# EAGLE design CalibrationBoard (EAGLE 6.5.0)
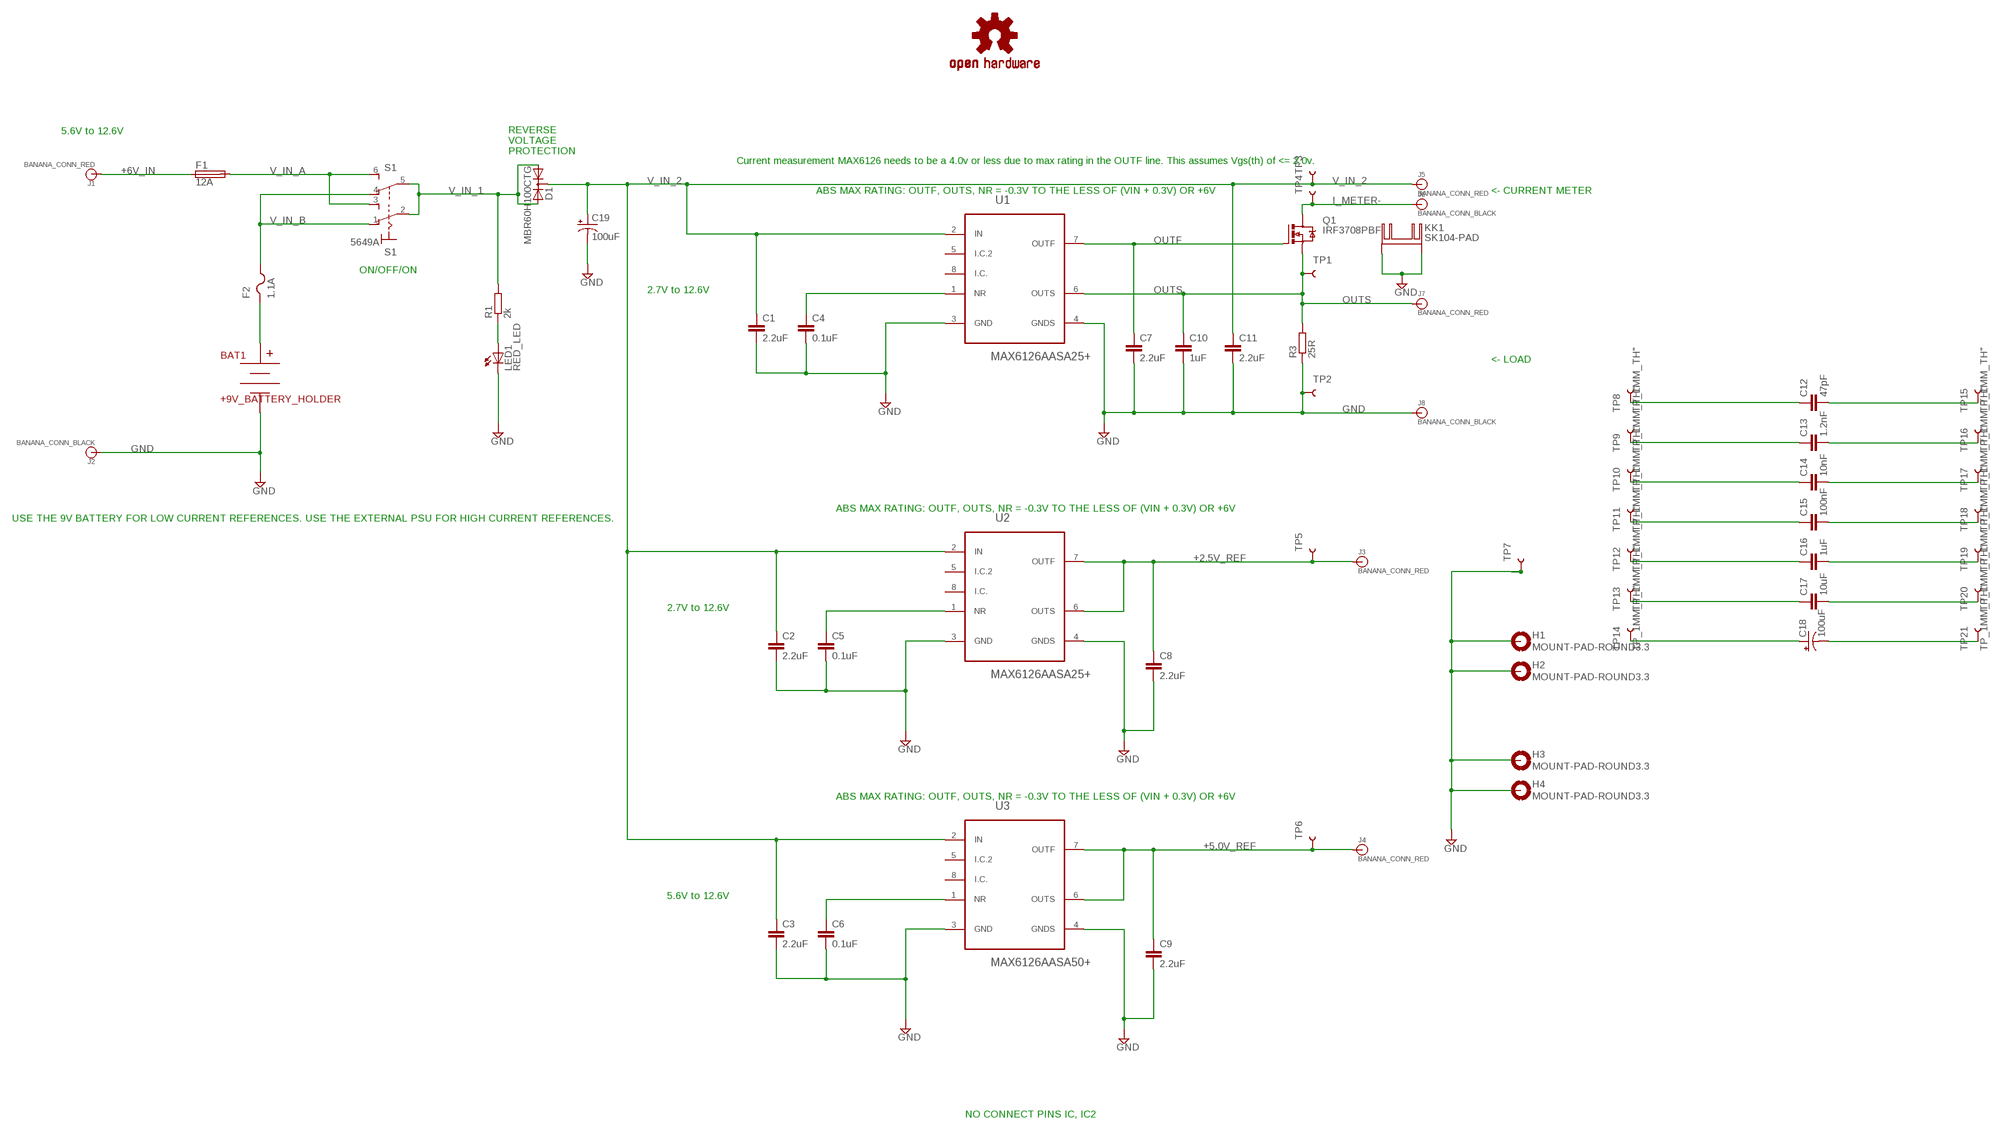
[diagram p0: schematic, sheet 1, part 1 of 2]
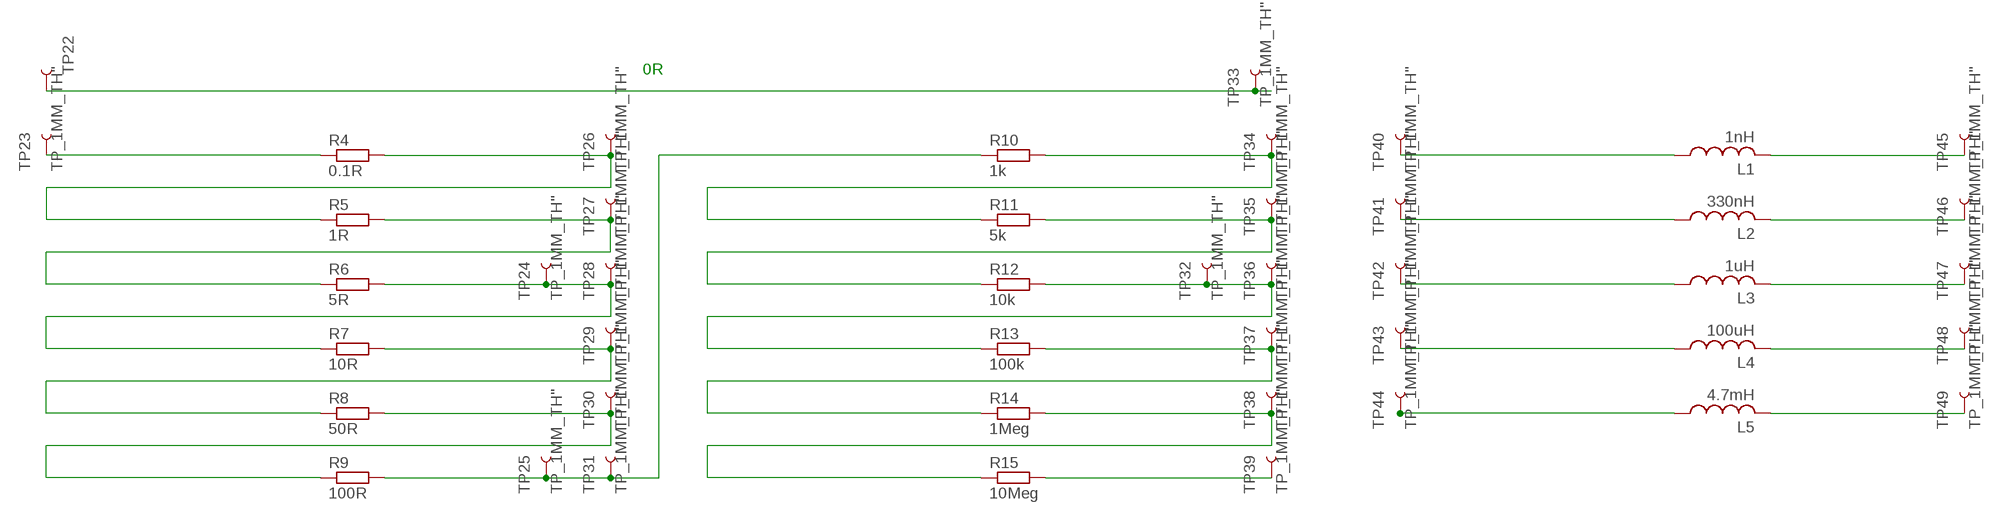
[diagram p1: schematic, sheet 1, part 2 of 2]

## Parts
BAT1  +9V_BATTERY_HOLDER  BC9VPC  [BC9VPC]
C1  2.2uF  C-EUC0805  [C0805]
C2  2.2uF  C-EUC0805  [C0805]
C3  2.2uF  C-EUC0805  [C0805]
C4  0.1uF  C-EUC0805  [C0805]
C5  0.1uF  C-EUC0805  [C0805]
C6  0.1uF  C-EUC0805  [C0805]
C7  2.2uF  C-EUC0805  [C0805]
C8  2.2uF  C-EUC0805  [C0805]
C9  2.2uF  C-EUC0805  [C0805]
C10  1uF  C-EUC0805  [C0805]
C11  2.2uF  C-EUC0805  [C0805]
C12  47pF  C-EUC0805  [C0805]
C13  1.2nF  C-EUC0805  [C0805]
C14  10nF  C-EUC0805  [C0805]
C15  100nF  C-EUC0805  [C0805]
C16  1uF  C-EUC0805  [C0805]
C17  10uF  C-EUC0805  [C0805]
C18  100uF  CPOL-USE5-10.5  [E5-10,5]
C19  100uF  CPOL-USE5-10.5  [E5-10,5]
D1  MBR60H100CTG  DIODE-2AC|CATO220V  [TO220ABS]
F1  12A  RGEF1200  [RGEF1200]
F2  1.1A  PTCFUSE-1812  [1812]
H1  MOUNT-PAD-ROUND3.3  [3,3-PAD]
H2  MOUNT-PAD-ROUND3.3  [3,3-PAD]
H3  MOUNT-PAD-ROUND3.3  [3,3-PAD]
H4  MOUNT-PAD-ROUND3.3  [3,3-PAD]
J1  BANANA_CONN_RED  BANANA_CONN  [BANANA_CONN]
J2  BANANA_CONN_BLACK  BANANA_CONN  [BANANA_CONN]
J3  BANANA_CONN_RED  BANANA_CONN  [BANANA_CONN]
J4  BANANA_CONN_RED  BANANA_CONN  [BANANA_CONN]
J5  BANANA_CONN_RED  BANANA_CONN  [BANANA_CONN]
J6  BANANA_CONN_BLACK  BANANA_CONN  [BANANA_CONN]
J7  BANANA_CONN_RED  BANANA_CONN  [BANANA_CONN]
J8  BANANA_CONN_BLACK  BANANA_CONN  [BANANA_CONN]
KK1  SK104-PAD  [SK104-PAD]
L1  1nH  L-USL1812  [L1812]
L2  330nH  L-USL2825P  [L2825P]
L3  1uH  L-USL1812  [L1812]
L4  100uH  L-USL1812  [L1812]
L5  4.7mH  L-US6000-XXX-RC  [6000-XXXX-RC]
LED1  RED_LED  LEDP-LCC-2  [P-LCC-2]
LOGO1  OSHW-LOGOL  [OSHW-LOGO-L]
Q1  IRF3708PBF  IRF540  [TO220BV]
R1  2k  R-EU_R0805  [R0805]
R3  25R  R-EU_R0805  [R0805]
R4  0.1R  R-EU_R0805  [R0805]
R5  1R  R-EU_R0805  [R0805]
R6  5R  R-EU_R0805  [R0805]
R7  10R  R-EU_R0805  [R0805]
R8  50R  R-EU_R0805  [R0805]
R9  100R  R-EU_R0805  [R0805]
R10  1k  R-EU_R0805  [R0805]
R11  5k  R-EU_R0805  [R0805]
R12  10k  R-EU_R0805  [R0805]
R13  100k  R-EU_R0805  [R0805]
R14  1Meg  R-EU_R0805  [R0805]
R15  10Meg  R-EU_R0805  [R0805]
S1  5649A  320-938  [320-938]
TP1  TP_1MM_TH"  [TP_1MM_TH]
TP2  TP_1MM_TH"  [TP_1MM_TH]
TP3  TP_1MM_TH"  [TP_1MM_TH]
TP4  TP_1MM_TH"  [TP_1MM_TH]
TP5  TP_1MM_TH"  [TP_1MM_TH]
TP6  TP_1MM_TH"  [TP_1MM_TH]
TP7  TP_1MM_TH"  [TP_1MM_TH]
TP8  TP_1MM_TH"  [TP_1MM_TH]
TP9  TP_1MM_TH"  [TP_1MM_TH]
TP10  TP_1MM_TH"  [TP_1MM_TH]
TP11  TP_1MM_TH"  [TP_1MM_TH]
TP12  TP_1MM_TH"  [TP_1MM_TH]
TP13  TP_1MM_TH"  [TP_1MM_TH]
TP14  TP_1MM_TH"  [TP_1MM_TH]
TP15  TP_1MM_TH"  [TP_1MM_TH]
TP16  TP_1MM_TH"  [TP_1MM_TH]
TP17  TP_1MM_TH"  [TP_1MM_TH]
TP18  TP_1MM_TH"  [TP_1MM_TH]
TP19  TP_1MM_TH"  [TP_1MM_TH]
TP20  TP_1MM_TH"  [TP_1MM_TH]
TP21  TP_1MM_TH"  [TP_1MM_TH]
TP22  TP_1MM_TH"  [TP_1MM_TH]
TP23  TP_1MM_TH"  [TP_1MM_TH]
TP24  TP_1MM_TH"  [TP_1MM_TH]
TP25  TP_1MM_TH"  [TP_1MM_TH]
TP26  TP_1MM_TH"  [TP_1MM_TH]
TP27  TP_1MM_TH"  [TP_1MM_TH]
TP28  TP_1MM_TH"  [TP_1MM_TH]
TP29  TP_1MM_TH"  [TP_1MM_TH]
TP30  TP_1MM_TH"  [TP_1MM_TH]
TP31  TP_1MM_TH"  [TP_1MM_TH]
TP32  TP_1MM_TH"  [TP_1MM_TH]
TP33  TP_1MM_TH"  [TP_1MM_TH]
TP34  TP_1MM_TH"  [TP_1MM_TH]
TP35  TP_1MM_TH"  [TP_1MM_TH]
TP36  TP_1MM_TH"  [TP_1MM_TH]
TP37  TP_1MM_TH"  [TP_1MM_TH]
TP38  TP_1MM_TH"  [TP_1MM_TH]
TP39  TP_1MM_TH"  [TP_1MM_TH]
TP40  TP_1MM_TH"  [TP_1MM_TH]
TP41  TP_1MM_TH"  [TP_1MM_TH]
TP42  TP_1MM_TH"  [TP_1MM_TH]
TP43  TP_1MM_TH"  [TP_1MM_TH]
TP44  TP_1MM_TH"  [TP_1MM_TH]
TP45  TP_1MM_TH"  [TP_1MM_TH]
TP46  TP_1MM_TH"  [TP_1MM_TH]
TP47  TP_1MM_TH"  [TP_1MM_TH]
TP48  TP_1MM_TH"  [TP_1MM_TH]
TP49  TP_1MM_TH"  [TP_1MM_TH]
U1  MAX6126AASA25+  MAX6126AASA50+  [SOIC127P600X175-8N]
U2  MAX6126AASA25+  MAX6126AASA50+  [SOIC127P600X175-8N]
U3  MAX6126AASA50+  [SOIC127P600X175-8N]

## Nets
+2.5V_REF: C8.1 J3.P$1 TP5.P$1 U2.6(OUTS) U2.7(OUTF)
+5.0V_REF: C9.1 J4.P$1 TP6.P$1 U3.6(OUTS) U3.7(OUTF)
+6V_IN: F1.1 J1.P$1
GND: BAT1.V- C1.2 C2.2 C3.2 C4.2 C5.2 C6.2 C7.2 C8.2 C9.2 C10.2 C11.2 C19.- H1.B3,3(MOUNT) H2.B3,3(MOUNT) H3.B3,3(MOUNT) H4.B3,3(MOUNT) J2.P$1 J8.P$1 KK1.K1(K) KK1.K2(K) LED1.C R3.1 TP2.P$1 TP7.P$1 U1.3(GND) U1.4(GNDS) U2.3(GND) U2.4(GNDS) U3.3(GND) U3.4(GNDS)
I_METER-: J6.P$1 Q1.D TP4.P$1
N$1: C12.1 TP8.P$1
N$3: L1.2 TP45.P$1
N$5: R4.1 TP23.P$1
N$6: C6.1 U3.1(NR)
N$7: L2.2 TP46.P$1
N$8: R8.2 R9.1 TP30.P$1
N$9: BAT1.V+ F2.1
N$10: R4.2 R5.1 TP26.P$1
N$11: C17.2 TP20.P$1
N$12: R9.2 R10.1 TP25.P$1 TP31.P$1
N$13: R10.2 R11.1 TP34.P$1
N$14: L3.2 TP47.P$1
N$15: C5.1 U2.1(NR)
N$16: R11.2 R12.1 TP35.P$1
N$17: R13.2 R14.1 TP37.P$1
N$18: R6.2 R7.1 TP24.P$1 TP28.P$1
N$19: L4.2 TP48.P$1
N$20: L5.2 TP49.P$1
N$21: R14.2 R15.1 TP38.P$1
N$22: TP22.P$1 TP33.P$1
N$23: L1.1 TP40.P$1
N$24: R15.2 TP39.P$1
N$25: C18.+ TP14.P$1
N$26: C18.- TP21.P$1
N$28: C4.1 U1.1(NR)
N$29: R7.2 R8.1 TP29.P$1
N$30: LED1.A R1.1
N$31: R5.2 R6.1 TP27.P$1
N$34: R12.2 R13.1 TP32.P$1 TP36.P$1
N$48: C12.2 TP15.P$1
N$49: C13.2 TP16.P$1
N$50: C14.2 TP17.P$1
N$51: C15.2 TP18.P$1
N$52: C16.2 TP19.P$1
N$53: C13.1 TP9.P$1
N$54: C14.1 TP10.P$1
N$55: C15.1 TP11.P$1
N$56: C16.1 TP12.P$1
N$57: C17.1 TP13.P$1
N$59: L5.1 TP44.P$1
N$60: L4.1 TP43.P$1
N$61: L3.1 TP42.P$1
N$62: L2.1 TP41.P$1
OUTF: C7.1 Q1.G U1.7(OUTF)
OUTS: C10.1 J7.P$1 Q1.S R3.2 TP1.P$1 U1.6(OUTS)
V_IN_1: D1.A1 D1.A2 R1.2 S1.2(1:P) S1.5(B:P)
V_IN_2: C1.1 C2.1 C3.1 C11.1 C19.+ D1.C J5.P$1 TP3.P$1 U1.2(IN) U2.2(IN) U3.2(IN)
V_IN_A: F1.2 S1.3(1:S) S1.6(B:S)
V_IN_B: F2.2 S1.1(1:O) S1.4(B:O)
Unconnected: U1.5(I.C.2) U1.8(I.C.) U2.5(I.C.2) U2.8(I.C.) U3.5(I.C.2) U3.8(I.C.)

## Notes on the sheet
- 5.6V to 12.6V
- REVERSE
  VOLTAGE
  PROTECTION
- Current measurement MAX6126 needs to be a 4.0v or less due to max rating in the OUTF line. This assumes Vgs(th) of <= 2.0v.
- ABS MAX RATING: OUTF, OUTS, NR = -0.3V TO THE LESS OF (VIN + 0.3V) OR +6V | <- CURRENT METER
- ON/OFF/ON
- 2.7V to 12.6V
- 0R
- <- LOAD
- ABS MAX RATING: OUTF, OUTS, NR = -0.3V TO THE LESS OF (VIN + 0.3V) OR +6V
- USE THE 9V BATTERY FOR LOW CURRENT REFERENCES. USE THE EXTERNAL PSU FOR HIGH CURRENT REFERENCES.
- 2.7V to 12.6V
- ABS MAX RATING: OUTF, OUTS, NR = -0.3V TO THE LESS OF (VIN + 0.3V) OR +6V
- 5.6V to 12.6V
- NO CONNECT PINS IC, IC2

## Library data of the parts
BAT1 = SparkFun-Connectors:BC9VPC: 9V board-mount battery cradle; OC_FARNELL: unknown; PROD_ID: BATT-10855
C1-C11 C14 C16 C17 = rcl:C-EU: CAPACITOR, European symbol; OC_FARNELL: unknown
C12 = rcl:C-EU: CAPACITOR, European symbol; MF: AVX; MPN: 08052U470FAT2A; OC_FARNELL: 2332727
C13 = rcl:C-EU: CAPACITOR, European symbol; MF: VISHAY VITRAMON; MPN: VJ0805A122FXBMT; OC_FARNELL: 1650948
C15 = rcl:C-EU: CAPACITOR, European symbol; MF: AVX; MPN: 08055C104JAT2A; OC_FARNELL: 1740673
C18 C19 = rcl:CPOL-US: POLARIZED CAPACITOR, American symbol; OC_FARNELL: unknown
D1 = diode:DIODE-2AC|CA: Dual DIODE Anode-Cathode|Cathode-Anode; MF: ON SEMICONDUCTOR; MPN: MBR60H100CTG; OC_FARNELL: 1431072
F1 = RGEF1200:RGEF1200: TE CONNECTIVITY/RAYCHEM Resettable Fuse Radial Leaded; MF: TE CONNECTIVITY / RAYCHEM; MPN: RGEF1200; OC_FARNELL: 1345957; OC_NEWARK: unknown
F2 = adafruit:PTCFUSE: PTC fuses, resettable thermistors; MF: TE CONNECTIVITY / RAYCHEM; MPN: MINISMDC110F/24-2; OC_FARNELL: 1345925
H1-H4 = holes:MOUNT-PAD-ROUND: MOUNTING PAD, round
J1-J8 = SparkFun-Connectors:BANANA_CONN: Through-hole banana jack; MF: HIRSCHMANN TEST AND MEASUREMENT; MPN: 972354101; OC_FARNELL: 1011402
KK1 = heatsink:SK104-PAD: HEATSINK manufacturer Fischer/distributor Buerklin; MF: FISCHER ELEKTRONIK; MPN: SK 129 38,1 STS; OC_FARNELL: 1319811
L1 = rcl:L-US: INDUCTOR, American symbol; OC_FARNELL: unknown
L2 = rcl:L-US: INDUCTOR, American symbol; MF: BOURNS; MPN: CW252016-R33G; OC_FARNELL: 2333647
L3 = rcl:L-US: INDUCTOR, American symbol; MF: COILCRAFT; MPN: 1812PS-102JLC; OC_FARNELL: 2287053
L4 = rcl:L-US: INDUCTOR, American symbol; MF: COILCRAFT; MPN: 1812PS-104JLB; OC_FARNELL: 2287073
L5 = rcl:L-US: INDUCTOR, American symbol; MF: WURTH ELEKTRONIK; MPN: 7447721047; OC_FARNELL: 2211696
LED1 = P-LCC-2_Shorter:LED: LED OSRAM: - CHIPLED LG R971, LG N971, LY N971, LG Q971, LY Q971, LO R971, LY R971 LH N974, LH R974 LS Q976, LO Q976, LY Q976 LO Q996 - Hyper CHIPLED LW Q18S LB Q993, LB Q99A, LB R99A - SideLED LS A670, LO A670, LY A670, LG A670, LP A670 LB A673, LV A673, LT A673, LW A673 LH A674 LY A675 LS A676, LA A676, LO A676, LY A676, LW A676 LS A679, LY A679, LG A679 - Hyper Micro SIDELED® LS Y876, LA Y876, LO Y876, LY Y876 LT Y87S - SmartLED LW L88C, LW L88S LB L89C, LB L89S, LG L890 LS L89K, LO L89K, LY L89K LS L896, LA L896, LO L896, LY L896 - TOPLED LS T670, LO T670, LY T670, LG T670, LP T670 LSG T670, LSP T670, LSY T670, LOP T670, LYG T670 LG T671, LOG T671, LSG T671 LB T673, LV T673, LT T673, LW T673 LH T674 LS T676, LA T676, LO T676, LY T676, LB T676, LH T676, LSB T676, LW T676 LB T67C, LV T67C, LT T67C, LS T67K, LO T67K, LY T67K, LW E67C LS E67B, LA E67B, LO E67B, LY E67B, LB E67C, LV E67C, LT E67C LW T67C LS T679, LY T679, LG T679 LS T770, LO T770, LY T770, LG T770, LP T770 LB T773, LV T773, LT T773, LW T773 LH T774 LS E675, LA E675, LY E675, LS T675 LS T776, LA T776, LO T776, LY T776, LB T776 LHGB T686 LT T68C, LB T68C - Hyper Mini TOPLED® LB M676 - Mini TOPLED Santana® LG M470 LS M47K, LO M47K, LY M47K Source: http://www.osram.convergy.de/; MF: DIALIGHT; MPN: 597-3121-207F; OC_FARNELL: 1519491
LOGO1 = SparkFun-Aesthetics:OSHW-LOGO: Open Source Hardware Logo This logo indicates the piece of hardware it is found on incorporates a OSHW license and/or adheres to the definition of open source hardware found here: http://freedomdefined.org/OSHW; OC_FARNELL: unknown
Q1 = transistor-power:IRF540: HEXFET Power MOSFET; MF: INTERNATIONAL RECTIFIER; MPN: IRF3708PBF; OC_FARNELL: 8648158
R1 R3 R6 R8 R11 R15 = rcl:R-EU_: RESISTOR, European symbol; OC_FARNELL: unknown
R4 = rcl:R-EU_: RESISTOR, European symbol; MF: PANASONIC ELECTRONIC COMPONENTS; MPN: ERJ6RSFR10V; OC_FARNELL: 1717785
R5 = rcl:R-EU_: RESISTOR, European symbol; MF: BOURNS; MPN: CR0805-FX-1R00ELF; OC_FARNELL: 2333617
R7 = rcl:R-EU_: RESISTOR, European symbol; MF: BOURNS; MPN: CRT0805-BY-10R0ELF; OC_FARNELL: 2008313
R9 = rcl:R-EU_: RESISTOR, European symbol; MF: SUSUMU; MPN: RR1220P-101-B-T5; OC_FARNELL: 1653279
R10 = rcl:R-EU_: RESISTOR, European symbol; MF: PANASONIC ELECTRONIC COMPONENTS; MPN: ERA6AEB102V; OC_FARNELL: 1577659
R12 = rcl:R-EU_: RESISTOR, European symbol; MF: SUSUMU; MPN: RR1220P-103-B-T5; OC_FARNELL: 1653282
R13 = rcl:R-EU_: RESISTOR, European symbol; MF: SUSUMU; MPN: RR1220P-104-B-T5; OC_FARNELL: 1653285
R14 = rcl:R-EU_: RESISTOR, European symbol; MF: SUSUMU; MPN: RR1220P-105-B-T5; OC_FARNELL: 1653287
S1 = Switch_320-938_Corrected:320-938: TOGGLE SWITCH distributor RS Components; MF: APEM; MPN: 5649A; OC_FARNELL: 1082316
TP1-TP49 = TP_1MM_TH:TP_1MM_TH: Bare copper test points for troubleshooting or ICT; MF: MULTICOMP; MPN: TEST-3; OC_FARNELL: 1702006
U1 U2 = MAX6126AASA50+:MAX6126AASA50+; DESCRIPTION: Low-Noise, Precision, +2.5V/+4.096V/+5V Voltage References; MF: MAXIM INTEGRATED PRODUCTS; MPN: MAX6126AASA25+; OC_FARNELL: 1673170; OC_NEWARK: -; PACKAGE: SOIC-8; SUPPLIER: Maxim
U3 = MAX6126AASA50+:MAX6126AASA50+; DESCRIPTION: Low-Noise, Precision, +2.5V/+4.096V/+5V Voltage References; OC_FARNELL: unknown; OC_NEWARK: -; PACKAGE: SOIC-8; SUPPLIER: Maxim

## Board
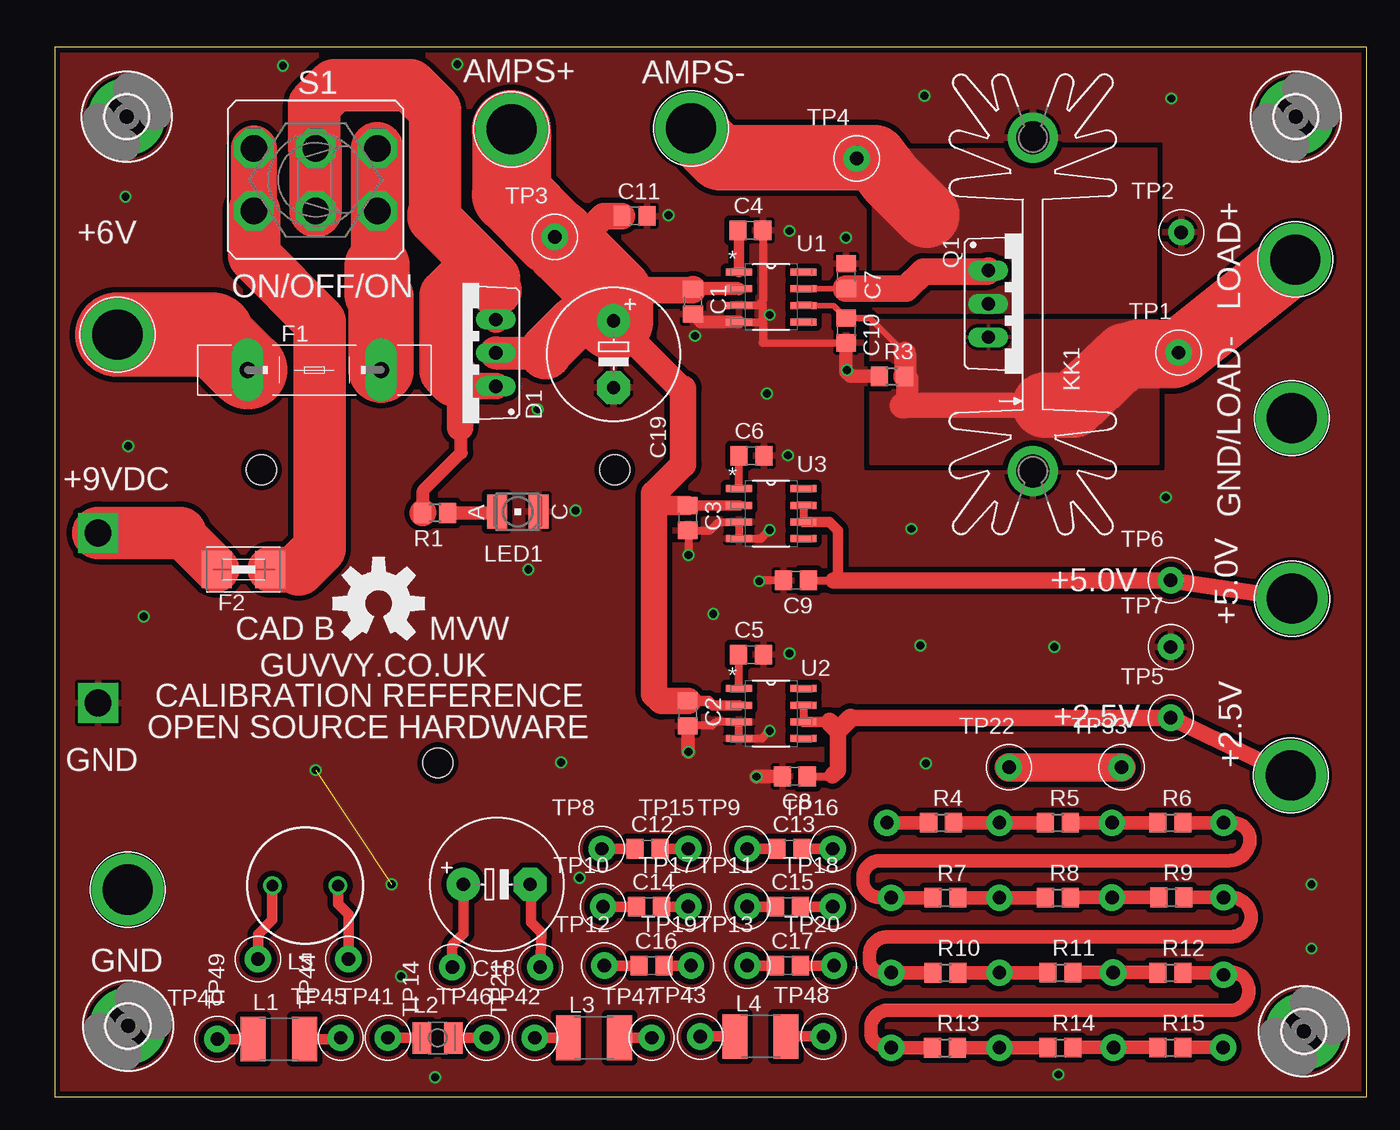
[diagram p2: board, top side]
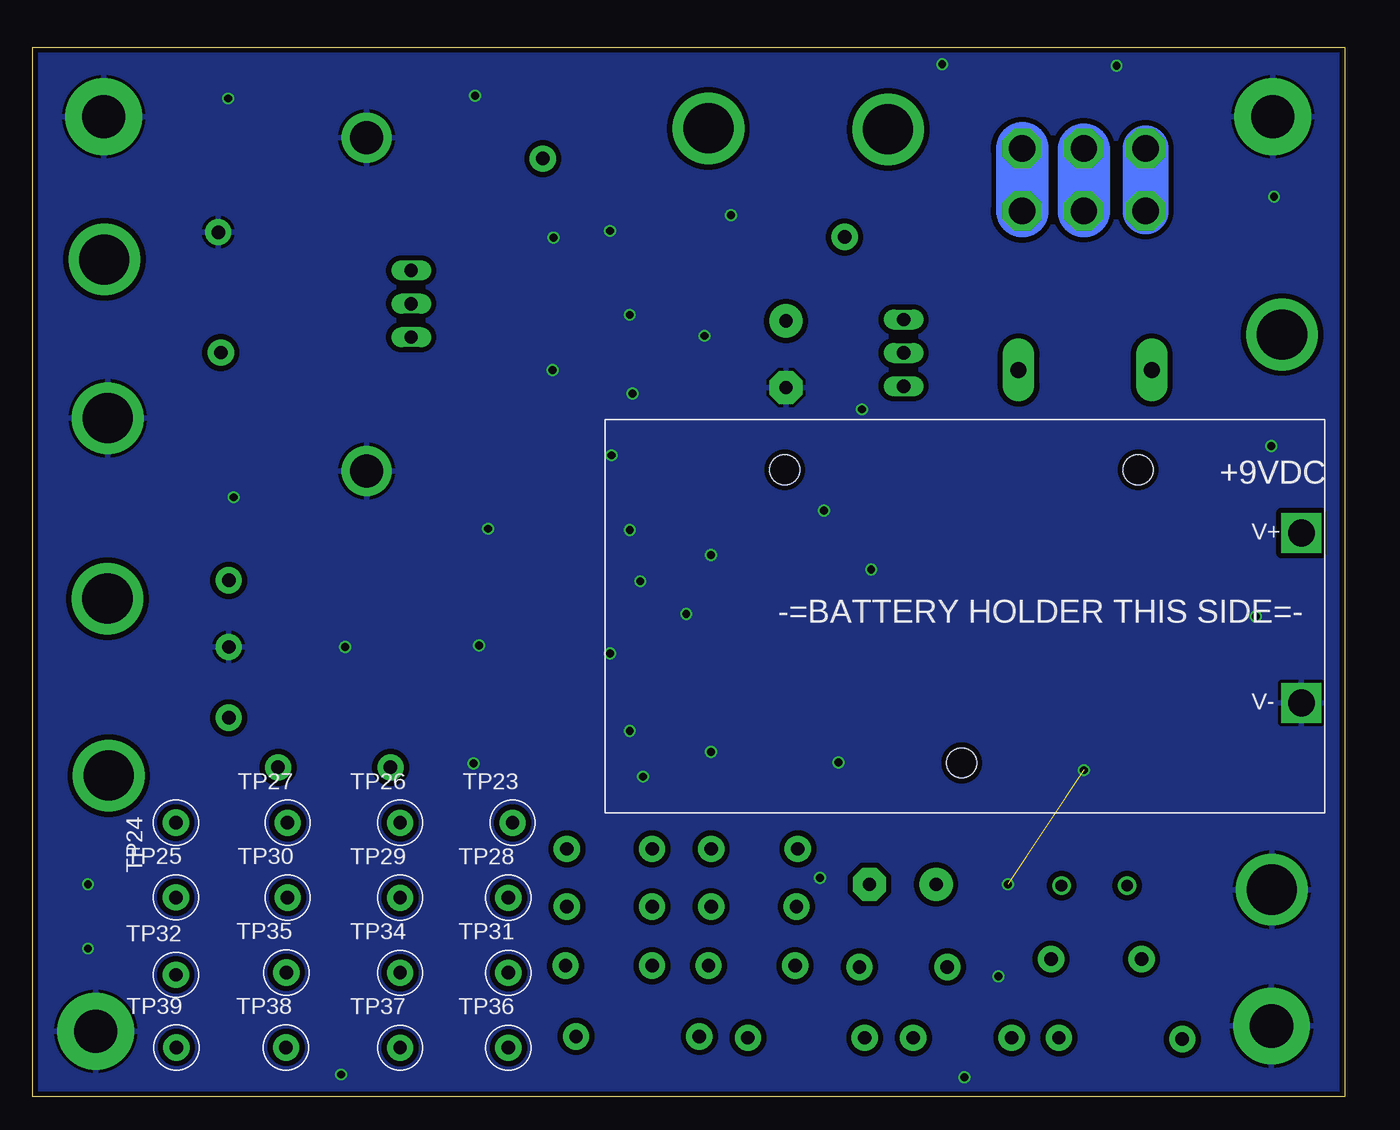
[diagram p3: board, bottom side, seen from below]

Size 100 x 80 mm. Coordinates in mm from the lower left corner, seen from the top.
Outline: 0,0 100,0 100,80 0,80 0,0
Copper layers (1*16): Top 0.035mm / dielectric 1.5mm / Bottom 0.035mm
Design rules "ITEADstudio_DRC": minimum track width 6mil, minimum drill 12mil, track to track 6mil, track to pad 6mil, pad to pad 6mil, via to via 6mil, smd to smd 0mil, copper to edge 10mil, drill to drill 10mil, minimum pad ring 10mil, minimum via ring 6mil, stop-mask expansion 2mil, vias tented up to drill 100mil, thermal gap 10mil

### Footprints (pad centres in the part's own frame; a part is rotated, then mirrored left to right if it is on the bottom)
BC9VPC = drill 2.032 square: V+ 53.086,21.336; V- 53.086,8.382 | hole 2.286: 27.178,3.81; 13.716,26.162; 40.64,26.162
C0805 = smd 1.3 x 1.5: 1 -0.95,0; 2 0.95,0
E5-10,5 = drill 1.016 pad 2.54: + -2.54,0 | drill 1.016 pad 2.54 octagon: - 2.54,0
TO220ABS = drill 1.016 long: A1 -2.54,-2.54; A2 2.54,-2.54; C 0,-2.54
RGEF1200 = drill 1.2 pad 2.4 long: 1 -5.08,0; 2 5.08,0
1812 = smd 2.286 x 2.794: 1 -2.046,0; 2 2.046,0
3,3-PAD = drill 3.3 pad 5.842: B3,3 0,0
BANANA_CONN = drill 3.81 pad 5.461: P$1 0,0
SK104-PAD = drill 2.54 pad 3.81: K1 -12.7,-0.762; K2 12.7,-0.762
L1812 = smd 1.9 x 3.4: 1 -1.95,0; 2 1.95,0
L2825P = smd 1.4 x 2.4: 1 -1.2,0; 2 1.2,0
6000-XXXX-RC = drill 0.9 pad 1.422: 1 -2.5,0; 2 2.5,0
P-LCC-2 = smd 2.6 x 1.5: A 0,1.58; C 0,-1.58
TO220BV = drill 1.016 long: D 0,-2.54; G -2.54,-2.54; S 2.54,-2.54
R0805 = smd 1.3 x 1.5: 1 -0.95,0; 2 0.95,0
320-938 = drill 2.007 octagon: 1 -2.388,4.7; 2 -2.388,0; 3 -2.388,-4.7; 4 2.388,4.7; 5 2.388,0; 6 2.388,-4.7
TP_1MM_TH = drill 1.02 pad 2: P$1 0,0
SOIC127P600X175-8N = smd 1.981 x 0.533: 1 -2.464,1.905; 2 -2.464,0.635; 3 -2.464,-0.635; 4 -2.464,-1.905; 5 2.464,-1.905; 6 2.464,-0.635; 7 2.464,0.635; 8 2.464,1.905

### Placement (x,y rotation side)
BAT1  56.4,21.64 0 bottom
C1  48.66,60.61 270 top
C2  48.26,29.21 270 top
C3  48.26,44.13 270 top
C4  53.02,66.04 0 top
C5  53.08,33.71 0 top
C6  53.1,48.87 0 top
C7  60.33,62.55 90 top
C8  56.41,24.43 180 top
C9  56.51,39.37 180 top
C10  60.33,58.42 270 top
C11  44.19,67.13 0 top
C12  45.2,18.9 0 top
C13  56,18.9 0 top
C14  45.3,14.5 0 top
C15  55.9,14.5 0 top
C16  45.5,10 0 top
C17  55.9,10 0 top
C18  33.7,16.2 0 top
C19  42.6,56.6 270 top
D1  31.1,56.7 90 top
F1  19.8,55.4 0 top
F2  14.4,40.2 0 top
H1  5.5,74.7 0 top
H2  94.6,74.7 0 top
H3  5.6,5.4 0 top
H4  95.2,5 0 top
J1  4.79,58.09 0 top
J2  5.57,15.79 0 top
J3  94.21,24.49 0 top
J4  94.31,37.97 0 top
J5  34.81,73.74 0 top
J6  48.51,73.81 0 top
J7  94.55,63.83 0 top
J8  94.29,51.73 0 top
KK1  73.8,60.4 90 top
L1  17.1,4.4 0 top
L2  29.2,4.5 0 top
L3  41.1,4.5 0 top
L4  53.8,4.6 0 top
L5  19.1,16.1 180 top
LED1  35.3,44.6 90 top
LOGO1  24.7,37.6 0 top
Q1  73.7,60.44 270 top
R1  29,44.5 180 top
R3  63.82,54.93 0 top
R4  67.56,20.89 0 top
R5  76.45,20.89 0 top
R6  85.03,20.89 0 top
R7  67.88,15.18 0 top
R8  76.45,15.19 0 top
R9  85.11,15.21 0 top
R10  67.9,9.46 0 top
R11  76.66,9.48 0 top
R12  85.03,9.46 0 top
R13  67.86,3.75 0 top
R14  76.66,3.76 0 top
R15  85.03,3.76 0 top
S1  19.9,69.9 90 top
TP1  85.67,56.73 0 top
TP2  85.87,65.9 0 top
TP3  38.13,65.54 0 top
TP4  61.13,71.52 0 top
TP5  85.07,28.89 0 top
TP6  85.07,39.37 0 top
TP7  85.07,34.29 0 top
TP8  41.7,18.9 0 top
TP9  52.8,18.9 0 top
TP10  41.8,14.5 0 top
TP11  52.8,14.5 0 top
TP12  41.9,10 0 top
TP13  52.8,10 0 top
TP14  30.3,9.9 90 top
TP15  48.3,18.9 0 top
TP16  59.3,18.9 0 top
TP17  48.3,14.5 0 top
TP18  59.3,14.5 0 top
TP19  48.5,10 0 top
TP20  59.4,10 0 top
TP21  37,9.9 90 top
TP22  72.74,25.12 0 top
TP23  63.44,20.89 0 bottom
TP24  89.1,20.9 90 bottom
TP25  89.1,15.2 0 bottom
TP26  72.01,20.89 0 bottom
TP27  80.58,20.89 0 bottom
TP28  63.76,15.18 0 bottom
TP29  72.01,15.18 0 bottom
TP30  80.58,15.19 0 bottom
TP31  63.76,9.46 0 bottom
TP32  89.1,9.3 0 bottom
TP33  81.31,25.12 0 top
TP34  72.01,9.46 0 bottom
TP35  80.68,9.48 0 bottom
TP36  63.76,3.75 0 bottom
TP37  72.01,3.75 0 bottom
TP38  80.7,3.76 0 bottom
TP39  89.06,3.76 0 bottom
TP40  12.4,4.4 0 top
TP41  25.4,4.5 0 top
TP42  36.6,4.5 0 top
TP43  49.2,4.6 0 top
TP44  22.4,10.5 90 top
TP45  21.8,4.5 0 top
TP46  32.9,4.5 0 top
TP47  45.5,4.5 0 top
TP48  58.6,4.6 0 top
TP49  15.5,10.5 90 top
U1  54.61,60.96 0 top
U2  54.61,29.21 0 top
U3  54.61,44.45 0 top

### Tracks (layer width: path | path; a pad name or v marks a point on that pad's centre or on a via)
+2.5V_REF
  Top 0.61: C8.1 59.23,24.43 59.3,24.5 | U2.7 U2.6
  Top 0.813: U2.6 59.05,28.57
  Top 1.27: J3.P$1 TP5.P$1 60.64,28.89 | 59.69,27.94 59.69,24.89 59.3,24.5
  Top 1.422: 60.64,28.89 59.69,27.94 59.05,28.57
+5.0V_REF
  Top 0.61: C9.1 59.37,39.37 | U3.7 U3.6
  Top 0.813: U3.6 59.05,43.81 59.69,43.18 59.69,39.69 59.37,39.37
  Top 1.27: J4.P$1 TP6.P$1 59.37,39.37
+6V_IN
  Top 6: 12.03,58.09 F1.1
  Top 6.452: J1.P$1 12.03,58.09
GND  (via drill 0.6)  (1 unrouted)
  Top 0.61: C4.2 53.97,60.64 | 53.97,60.64 53.66,60.33 U1.3 | U1.4 53.98,59.05 | 53.98,59.05 53.97,60.64 | 53.98,59.05 53.98,57.47 C10.2 | v54.5,27.9 53.91,27.3 U2.4 U2.3 50.38,28.57 50.1,28.3 48.3,28.3 C2.2 | v54.5,43.2 53.84,42.55 U3.4 U3.3 52.13,43.8 50.6,43.8 49.98,43.18 C3.2 48.28,43.18 48.3,43.2 v48.3,41.3 | C9.2 53.77,39.37 v53.7,39.3
  Top 1: U1.4 49.26,59.05 C1.2
  Top 1.016: R3.1 60.64,54.93 60.33,55.24 C10.2 | C2.2 48.26,26.34 arc90 v48.3,26.3 | C8.2 53.53,24.43 arc90 v53.5,24.4
  other vias: 48.8,58 54.5,59.6 55.9,48.9 56,33.8 56,66 60.3,65.5 6.8,36.6 60.4,55.4 25.7,16.2 50.2,36.8 46.8,67.2 36.1,40.2 30.7,78.7 5.4,68.6 39.7,44.7 19.9,24.9 38.6,25.5 95.8,16.2 66.4,25.4 66,34.4 65.3,43.3 66.3,76.3 85.1,76.1 54.3,53.6 36.8,52.4 17.4,78.6 5.6,49.6 29,1.5 76.5,1.7 26.4,9.2 76.2,34.3 95.8,11.3 84.7,45.7 40,16.7
  pour Top (isolate 0.406, rank 3): -2.54,-2.54 -2.54,82.55 102.87,82.55 102.87,-2.54
  pour Bottom (isolate 0.406, rank 3): -1.27,81.28 101.6,81.28 101.6,-2.54 -1.27,-2.54
I_METER-
  Top 2: TP4.P$1 50.81,71.52 J6.P$1
  Top 5: 66.5,67.2 63.7,70 62.5,71.6 50.73,71.6 J6.P$1
  pour Top (isolate 0.406, rank 2, no thermals): 62.37,72.16 83.94,72.25 83.84,50.69 62.47,50.79
N$1
  Top 0.813: TP8.P$1 C12.1
N$3
  Top 0.813: L1.2 21.7,4.4 arc90 TP45.P$1
N$5
  Top 1.016: TP23.P$1 R4.1
N$6
  Top 0.61: U3.1 C6.1
N$7
  Top 0.813: L2.2 TP46.P$1
N$8
  Top 1.016: R8.2 TP30.P$1 84.16,15.19 R9.1
N$9
  Top 3.5: 9.58,42.98 F2.1
  Top 4: BAT1.V+ 9.58,42.98
N$10
  Top 1.016: R4.2 TP26.P$1 R5.1
N$11
  Top 0.813: C17.2 TP20.P$1
N$12
  Top 1.016: R10.1 TP31.P$1 arc-90 63.41,9.5 63,9.5 arc-90 62.1,10.4 62.1,10.8 arc-90 63.5,12.2 89.6,12.2 arc90 91.2,13.7 arc90 89.6,15.2 TP25.P$1 89.59,15.2 89.6,15.21 | R9.2 89.6,15.21 | 89.6,15.21 89.79,15.21
N$13
  Top 1.016: R10.2 TP34.P$1 75.7,9.46 R11.1
N$14
  Top 0.813: L3.2 TP47.P$1
N$15
  Top 0.61: U2.1 52.15,33.7 C5.1
N$16
  Top 1.016: R11.2 TP35.P$1 84.08,9.48 R12.1
N$17
  Top 1.016: R13.2 TP37.P$1 75.7,3.75 R14.1
N$18
  Top 1.016: R7.1 TP28.P$1 63.73,15.2 62.9,15.2 arc-90 61.6,16.5 61.6,16.7 arc-90 62.9,18 89.5,18 arc90 91.1,19.6 arc90 89.8,20.9 TP24.P$1 88.89,20.89 R6.2
N$19
  Top 0.813: L4.2 TP48.P$1
N$20
  Top 0.813: L5.2 16.6,13.5 15.5,12.4 TP49.P$1
N$21
  Top 1.016: R14.2 TP38.P$1 R15.1
N$22
  Top 2.184: TP22.P$1 TP33.P$1
N$23
  Top 0.813: TP40.P$1 L1.1
N$24
  Top 1.016: R15.2 TP39.P$1
N$25
  Top 0.813: C18.+ 31.16,12.46 30.4,11.7 30.4,11.6 30.3,11.5 TP14.P$1
N$26
  Top 0.813: TP21.P$1 37.1,12.5 36.3,13.3 36.3,16.14 C18.-
N$28
  Top 0.8: U1.1 52.15,65.97
  Top 1: 52.15,65.97 C4.1
N$29
  Top 1.016: R7.2 TP29.P$1 75.5,15.18 R8.1
N$30
  Top 1.016: R1.1 33.62,44.5 LED1.A
N$31
  Top 1.016: R5.2 TP27.P$1 R6.1
N$34
  Top 1.016: R13.1 TP36.P$1 arc-90 63.6,3.9 63.2,3.9 arc-90 62.2,4.9 62.2,5.4 arc-90 63.8,6.6 89.8,6.6 arc90 91,8.3 arc90 89.5,9.5 TP32.P$1 arc90 89.06,9.46 R12.2
N$48
  Top 0.813: C12.2 TP15.P$1
N$49
  Top 0.813: C13.2 TP16.P$1
N$50
  Top 0.813: C14.2 TP17.P$1
N$51
  Top 0.813: TP18.P$1 C15.2
N$52
  Top 0.813: C16.2 TP19.P$1
N$53
  Top 0.813: TP9.P$1 C13.1
N$54
  Top 0.813: C14.1 TP10.P$1
N$55
  Top 0.813: C15.1 TP11.P$1
N$56
  Top 0.813: C16.1 TP12.P$1
N$57
  Top 0.813: TP13.P$1 C17.1
N$59
  Top 0.813: L5.1 21.6,14.7 22.4,13.9 TP44.P$1
N$60
  Top 0.813: TP43.P$1 L4.1
N$61
  Top 0.813: TP42.P$1 L3.1
N$62
  Top 0.813: TP41.P$1 L2.1
OUTF
  Top 0.406: C7.1 U1.7
  Top 0.61: U1.7
  Top 1.422: C7.1
  Top 2: C7.1 64.9,61.6 66.2,62.9 71.08,62.9 Q1.G
OUTS
  Top 0.406: C10.1 59.37,60.33 U1.6
  Top 0.5: C10.1 62.13,59.37 64.8,56.7
  Top 0.61: C10.1
  Top 1.676: 64.8,56.7 64.8,54.96 R3.2 65,54.7 65,52.9
  Top 1.93: 75.47,52.73 64.6,52.7 64.8,52.7 65,52.9
  Top 5: J7.P$1 TP1.P$1 | 82.47,56.73 TP1.P$1 | 75.47,52.73 77.62,52.73 81.6,56.5 85.24,56.5 TP1.P$1
  pour Top (isolate 0.406): 84.09,48.27 62.23,48.27 62.23,59.16 84.09,59.16
V_IN_1
  Top 1: 28.1,44.55 28.1,46.2 31,49.1 31,50.9 30.9,51
  Top 2: 33.6,61.5 33.6,59.28 D1.A2 | D1.A1 32.24,54.16 32.2,54.2 30.9,54.2 | 30.9,54.2 30.5,54.6 | 30.9,54.2 30.9,51 | 28.1,44.55 R1.2
  Top 4: S1.5 S1.2 19.9,72.2 19.8,72.3 19.8,75.6 21.3,77.1 27.1,77.1 29,75.2 29,67.4 28.9,67.3 28.9,67 32.3,63.6 | 32.3,63.6 33.5,62.4 33.5,61.6 33.6,61.5 | 30.5,54.6 29.8,55.3 29.8,61.1 32.3,63.6
  Bottom 3.5: S1.2
  Bottom 4: 19.9,72.2 S1.2
V_IN_2
  Top 0.813: C2.1 49.85,30.16 50.16,29.84 U2.2 | C3.1 U3.2
  Top 1: U1.2 48.7,61.59 C1.1
  Top 1.27: C2.1
  Top 1.5: C3.1 46.02,45.08 45.7,45.4
  Top 2: C2.1 46.24,30.16 45.7,30.7 45.7,45.4 45.7,46 47.9,48.2 47.9,54 47.74,54 C19.+ | 42.6,61.1 44.7,61.1 45.1,61.5 48.6,61.5 C1.1 | C11.1 41.83,67.13 40.1,65.4 38.27,65.4 TP3.P$1 38.16,65.54 38.9,64.8
  Top 2.5: D1.C 37.4,56.7
  Top 4: 37.4,56.7 37.4,56.8 39.7,59.1 42.56,59.1 C19.+
  Top 6: J5.P$1 34.81,68.79 38,65.6 38.1,65.6 38.9,64.8 42.6,61.1 C19.+
V_IN_A
  Top 4: S1.6 S1.3 24.6,63.3
  Top 5: F1.2 24.88,60.92 24.6,61.2 24.6,63.3
  Bottom 3.5: S1.6
  Bottom 4: S1.6 S1.3
V_IN_B
  Top 3.5: S1.1 S1.4 | F2.2 18.6,40.2
  Top 4: 18.6,40.2 20.2,41.8 20.2,59.1 15.2,64.1 S1.1
  Bottom 3.5: S1.4 S1.1

### Text on the board
tNames: AMPS+ | AMPS- | +6V | LOAD+ | ON/OFF/ON | GND/LOAD- | +9VDC | +5.0V | +5.0V | CAD B | MVW | GUVVY.CO.UK | CALIBRATION REFERENCE | +2.5V | OPEN SOURCE HARDWARE | +2.5V | GND | GND
bNames: +9VDC | -=BATTERY HOLDER THIS SIDE=-